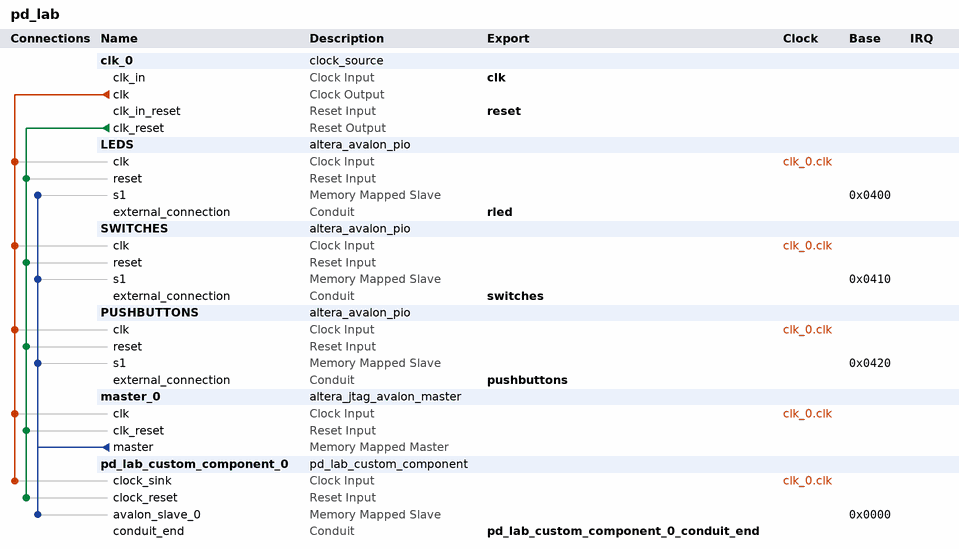
[diagram p0: system contents]
# Platform Designer (Qsys) system pd_lab, Cyclone V 5CSEMA5F31C6
# Parameters at their usual value, and those the tool derives, are not listed.
package require -exact qsys 25.1
create_system pd_lab
set_project_property DEVICE_FAMILY {Cyclone V}
set_project_property DEVICE 5CSEMA5F31C6

add_instance clk_0 clock_source 25.1
set_instance_parameter_value clk_0 clockFrequency 50000000

add_instance LEDS altera_avalon_pio 25.1
set_instance_parameter_value LEDS direction Output
set_instance_parameter_value LEDS width 10

add_instance SWITCHES altera_avalon_pio 25.1
set_instance_parameter_value SWITCHES direction Input
set_instance_parameter_value SWITCHES width 10

add_instance PUSHBUTTONS altera_avalon_pio 25.1
set_instance_parameter_value PUSHBUTTONS captureEdge true
set_instance_parameter_value PUSHBUTTONS direction Input
set_instance_parameter_value PUSHBUTTONS edgeType FALLING
set_instance_parameter_value PUSHBUTTONS generateIRQ true
set_instance_parameter_value PUSHBUTTONS irqType EDGE
set_instance_parameter_value PUSHBUTTONS width 4

add_instance master_0 altera_jtag_avalon_master 25.1

add_instance pd_lab_custom_component_0 pd_lab_custom_component 1.0

# connections
add_connection clk_0.clk LEDS.clk clock
add_connection clk_0.clk master_0.clk clock
add_connection clk_0.clk pd_lab_custom_component_0.clock_sink clock
add_connection clk_0.clk PUSHBUTTONS.clk clock
add_connection clk_0.clk SWITCHES.clk clock
add_connection clk_0.clk_reset LEDS.reset reset
add_connection clk_0.clk_reset master_0.clk_reset reset
add_connection clk_0.clk_reset pd_lab_custom_component_0.clock_reset reset
add_connection clk_0.clk_reset PUSHBUTTONS.reset reset
add_connection clk_0.clk_reset SWITCHES.reset reset
add_connection master_0.master LEDS.s1 avalon
set_connection_parameter_value master_0.master/LEDS.s1 baseAddress 0x0400
add_connection master_0.master pd_lab_custom_component_0.avalon_slave_0 avalon
set_connection_parameter_value master_0.master/pd_lab_custom_component_0.avalon_slave_0 baseAddress 0x0000
add_connection master_0.master PUSHBUTTONS.s1 avalon
set_connection_parameter_value master_0.master/PUSHBUTTONS.s1 baseAddress 0x0420
add_connection master_0.master SWITCHES.s1 avalon
set_connection_parameter_value master_0.master/SWITCHES.s1 baseAddress 0x0410

# exported interfaces
add_interface clk clock sink
set_interface_property clk EXPORT_OF clk_0.clk_in
add_interface pd_lab_custom_component_0_conduit_end conduit end
set_interface_property pd_lab_custom_component_0_conduit_end EXPORT_OF pd_lab_custom_component_0.conduit_end
add_interface pushbuttons conduit end
set_interface_property pushbuttons EXPORT_OF PUSHBUTTONS.external_connection
add_interface reset reset sink
set_interface_property reset EXPORT_OF clk_0.clk_in_reset
add_interface rled conduit end
set_interface_property rled EXPORT_OF LEDS.external_connection
add_interface switches conduit end
set_interface_property switches EXPORT_OF SWITCHES.external_connection

set_interconnect_requirement {$system} qsys_mm.clockCrossingAdapter HANDSHAKE
set_interconnect_requirement {$system} qsys_mm.enableEccProtection FALSE
set_interconnect_requirement {$system} qsys_mm.insertDefaultSlave FALSE
set_interconnect_requirement {$system} qsys_mm.maxAdditionalLatency 1

save_system pd_lab.qsys
